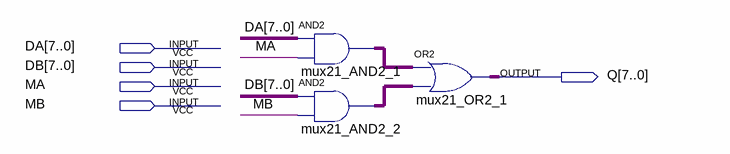
[diagram p0: schematic sheet]
// Quartus schematic mux21.bdf as structural Verilog: 3 symbols, 5 pins
module mux21 (
  input  [7:0] DA,
  input  [7:0] DB,
  input  MA,
  input  MB,
  output [7:0] Q
);

  wire [7:0] mux21_AND2_1_out, mux21_AND2_2_out;

  assign mux21_AND2_1_out = DA & {8{MA}};  // AND2 mux21_AND2_1, 8 bits wide
  assign mux21_AND2_2_out = DB & {8{MB}};  // AND2 mux21_AND2_2, 8 bits wide
  assign Q = mux21_AND2_1_out | mux21_AND2_2_out;  // OR2 mux21_OR2_1, 8 bits wide
endmodule
